# Altium schematic sheet LM2596_HV.SchDoc
size A4
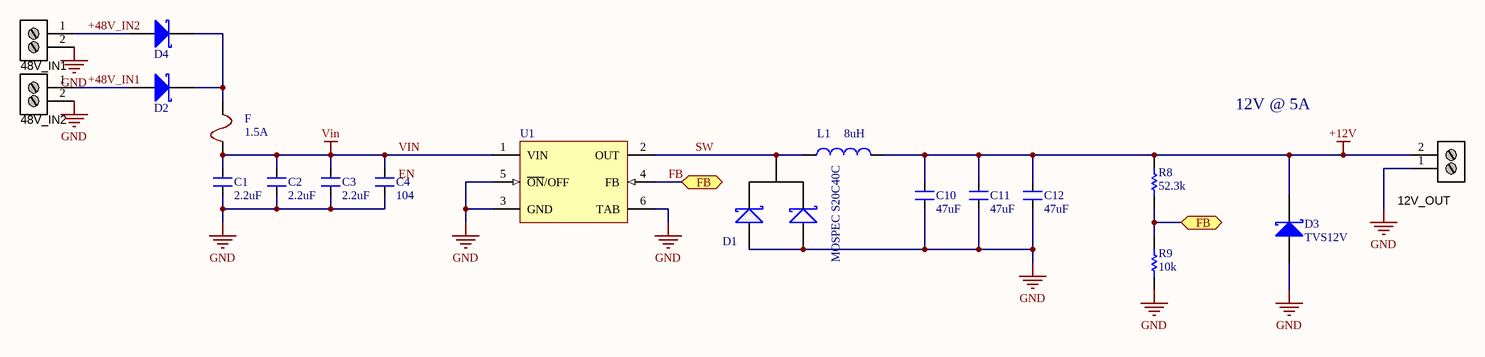
[diagram p0: LM2596_HV.SchDoc]

## Parts
12V_OUT  Stackable ScrewTerm  [2P_PCB_ScrewTerm_200mil]  (value not drawn)
48V_IN1  Stackable ScrewTerm  [2P_PCB_ScrewTerm_200mil]  (value not drawn)
48V_IN2  Stackable ScrewTerm  [2P_PCB_ScrewTerm_200mil]  (value not drawn)
C1  value 2.2uF  [CAPC3225N]  (hidden comment: CAP NP)
C2  value 2.2uF  [CAPC3225N]  (hidden comment: CAP NP)
C3  value 2.2uF  [CAPC3225N]  (hidden comment: CAP NP)
C4  value 104  [CAPC1608N]  (hidden comment: CAP NP)
C10  value 47uF  [CAPC3225N]  (hidden comment: CAP NP)
C11  value 47uF  [CAPC3225N]  (hidden comment: CAP NP)
C12  value 47uF  [CAPC3225N]  (hidden comment: CAP NP)
D1  MOSPEC S20C40C  [TO-220]
D2  (no value)  [DO-214AC]
D3  TVS12V  [DO-214AA]
D4  SS14  [DO-214AC]  (value not drawn)
F  1.5A  [FUSE_SR-5-BK]
L1  value 8uH  [Toroid]  (hidden comment: Inductor)
R8  value 52.3k  [RESC2012N]  (hidden comment: Res)
R9  value 10k  [RESC2012N]  (hidden comment: Res)
U1  LM2596S-ADJ  [TS5B_N]  (value not drawn)

## Ports
FB

## Nets
+12V: 12V_OUT.2 C10.2 C11.2 C12.2 D3.2(K) L1.2 R8.2
GND: 12V_OUT.1 48V_IN1.2 48V_IN2.2 C1.1 C2.1 C3.1 C4.1 C10.1 C11.1 C12.1 D1.1(A1) D1.3(K) D3.1(A) R9.1 U1.3(GND) U1.5(~{ON}/OFF) U1.6(TAB)
VIN: C1.2 C2.2 C3.2 C4.2 F.1 U1.1(VIN)
+48V_IN1: 48V_IN2.1 D2.1(A)
+48V_IN2: 48V_IN1.1 D4.1(A)
FB: R8.1 R9.2 U1.4(FB) ; port FB
SW: D1.2(A2) L1.1 U1.2(OUT)
NetD2_2: D2.2(K) D4.2(K) F.2

## Notes on the sheet
- 12V @ 5A
- Labels drawn without touching a wire or pin: EN

## Library data of the parts
12V_OUT 48V_IN1 48V_IN2 = 2P_ScrewTerm_90S_3.81MM: Terminal Block Screw Type THT 2-Position 3.81mm pitch; Manufacturer 1: Tyco Electronics; Manufacturer Part Number 1: 1776113-2; Value: 2 position; Pitch: 0.150" (3.81mm); Positions Per Level: 2; Package / Case: Side Entry; 3.81mm pitch; Category: Connectors Interconnects; Color: Black; Supplier 1: Digi-Key; Supplier Part Number 1: A97976-ND
D1 = Diode x2
D2-D4 = Diode Schottky: pin to pad: 1>A 2>K
F = Fuse
U1 = LM2596S-ADJ: SIMPLE SWITCHER Power Converter 150 KHz 3A Step-Down Voltage Regulator; Manufacturer: National Semiconductor; PackageTopMarking: NSUZXYTT*LM2596S*-ADJ P+; PowerWise: N; FirstPublished: 4-Dec-2008; DatasheetVersion: May-2002; PackageVersion: revD, Apr-2005; PackageReference: TS5B; Publisher: Altium Limited; PackageDescription: TO-263, Molded, .400 x .390 x .180in, 5 Lead, .067in Pitch, Surface Mount; CompType: Switcher; PartNumber: LM2596S-ADJ; RoHS: O; PinCount: 5; DigiKeyPartNumber: LM2596S-ADJ-ND; Code_JEDEC: MO-169-AB; ComponentLink1Description: LM2596 Datasheet; ComponentLink1URL: http://www.national.com/ds/LM/LM2596.pdf; ComponentLink2Description: LM2596 Web Page; ComponentLink2URL: http://www.national.com/pf/LM/LM2596.html; ComponentLink3Description: TS5B Package Page; ComponentLink3URL: http://www.national.com/packaging/folders/ts5b.html